# EAGLE design PSU (EAGLE 7.7.0)
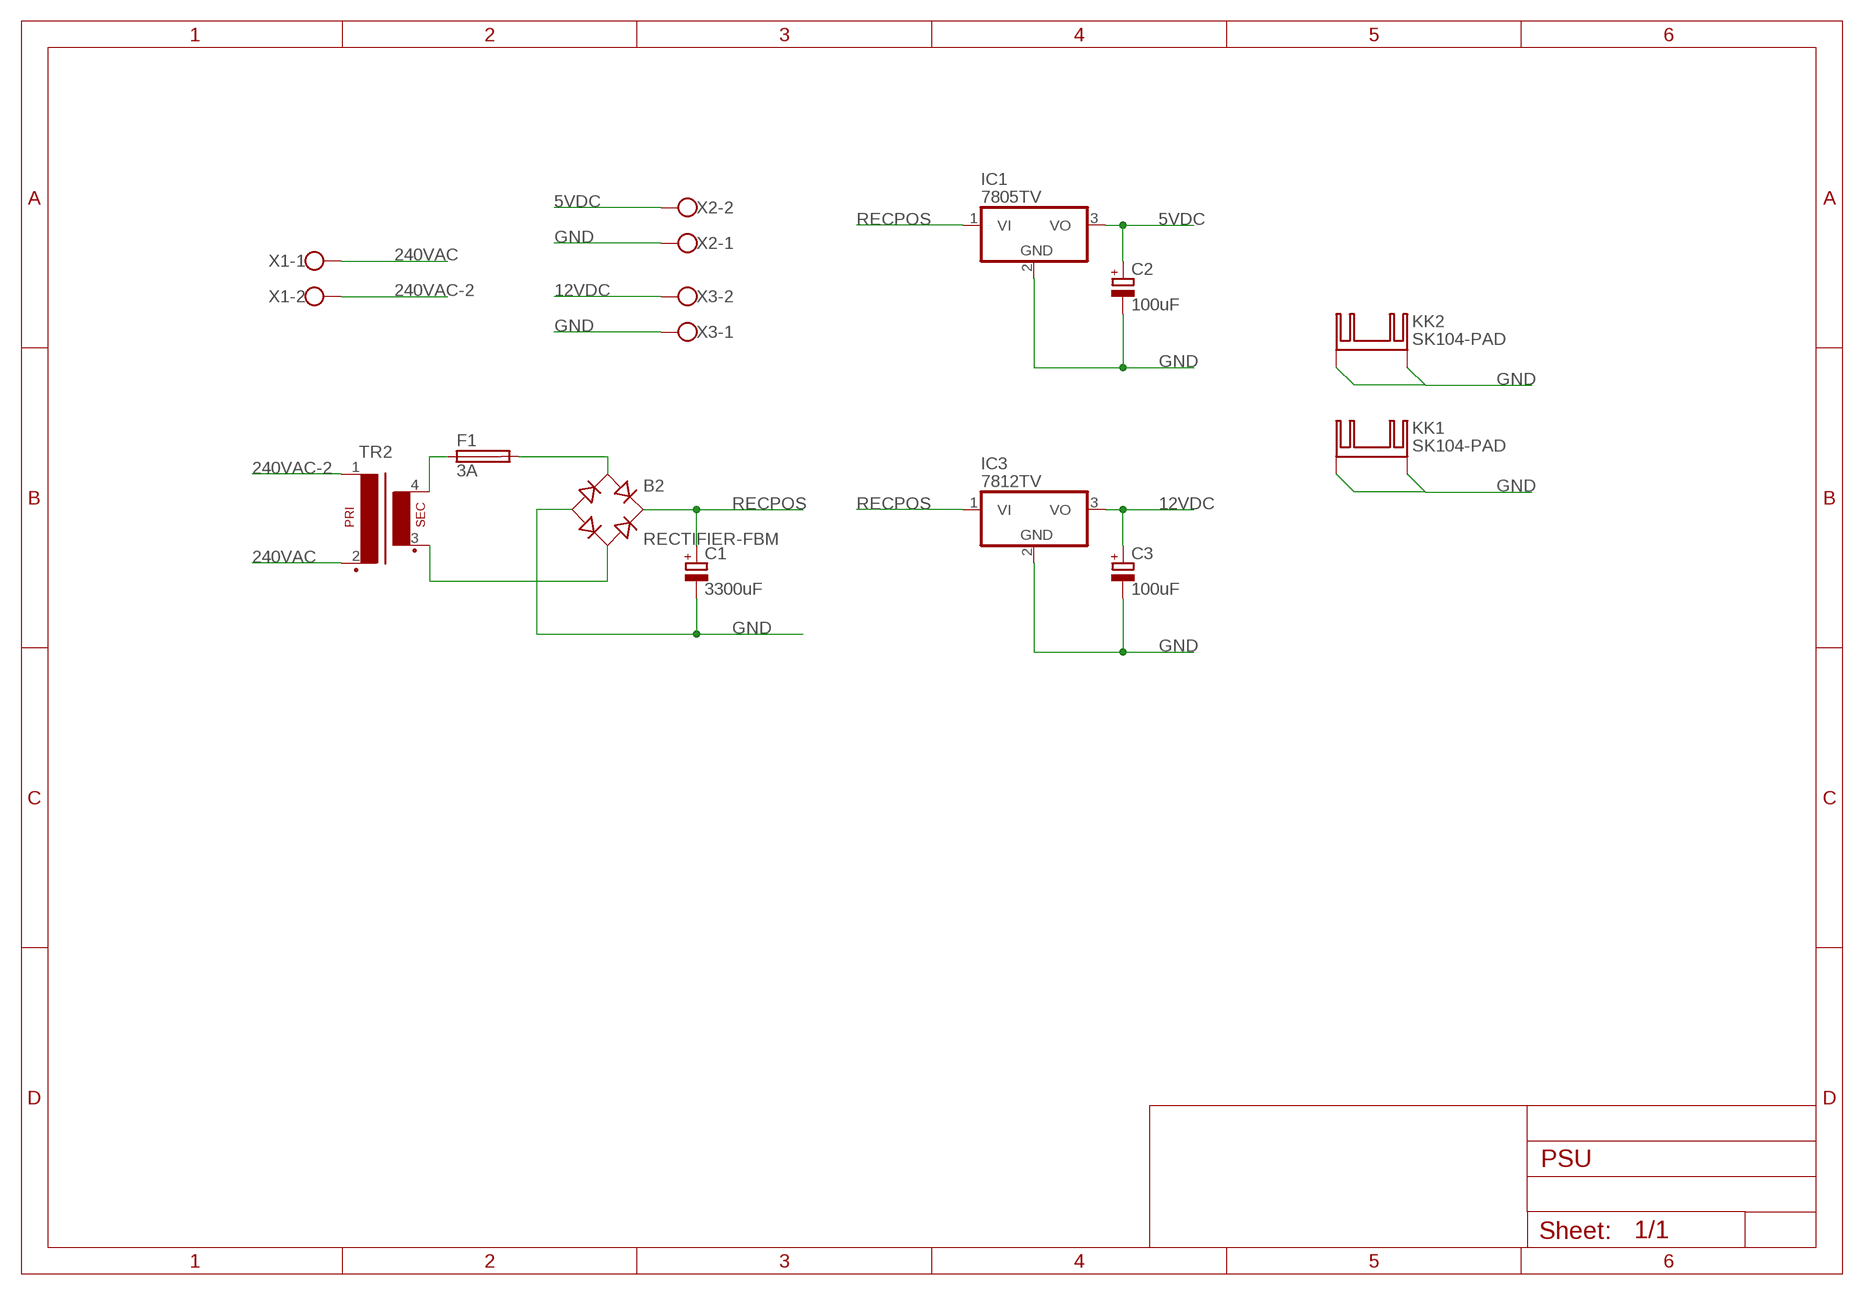
[diagram p0: schematic, sheet 1]

## Parts
B2  RECTIFIER-FBM  [FBM]
C1  3300uF  CPOL-EUE10-35  [EB35D]
C2  100uF  CPOL-EUE5-10.5  [E5-10,5]
C3  100uF  CPOL-EUE5-10.5  [E5-10,5]
F1  3A  SH25  [SH25]
IC1  7805TV  [TO220V]
IC3  7812TV  [TO220V]
KK1  SK104-PAD  [SK104-PAD]
KK2  SK104-PAD  [SK104-PAD]
TR2  VP31  [VP31]
X1  W237-102  [W237-102]
X2  W237-102  [W237-102]
X3  W237-102  [W237-102]

## Nets
5VDC: C2.+ IC1.3(VO) X2.2
12VDC: C3.+ IC3.3(VO) X3.2
240VAC: TR2.2 X1.1
240VAC-2: TR2.1 X1.2
GND: B2.- C1.- C2.- C3.- IC1.2(GND) IC3.2(GND) KK1.K1(K) KK1.K2(K) KK2.K1(K) KK2.K2(K) X2.1 X3.1
N$3: F1.1 TR2.4(S4)
N$4: B2.AC2 TR2.3(S3)
N$5: B2.AC1 F1.2
RECPOS: B2.+ C1.+ IC1.1(VI) IC3.1(VI)

## Library data of the parts
B2 = rectifier:RECTIFIER-: Rectifier
C1-C3 = rcl:CPOL-EU: POLARIZED CAPACITOR, European symbol
F1 = fuse:SH25: FUSE HOLDER grid 25 mm, OGN0031 8211, Schurter (Buerklin)
IC1 IC3 = linear:78*: Positive VOLTAGE REGULATOR Source: http://cache.national.com/ds/LM/LM78L05.pdf http://www.fairchildsemi.com/ds/LM/LM7805.pdf
KK1 KK2 = heatsink:SK104-PAD: HEATSINK manufacturer Fischer/distributor Buerklin
TR2 = trafo:VP31: TRANSFORMER 1 primary winding, 1 secondary winding BLOCK
X1-X3 = con-wago-500:W237-102: WAGO SCREW CLAMP

## Board
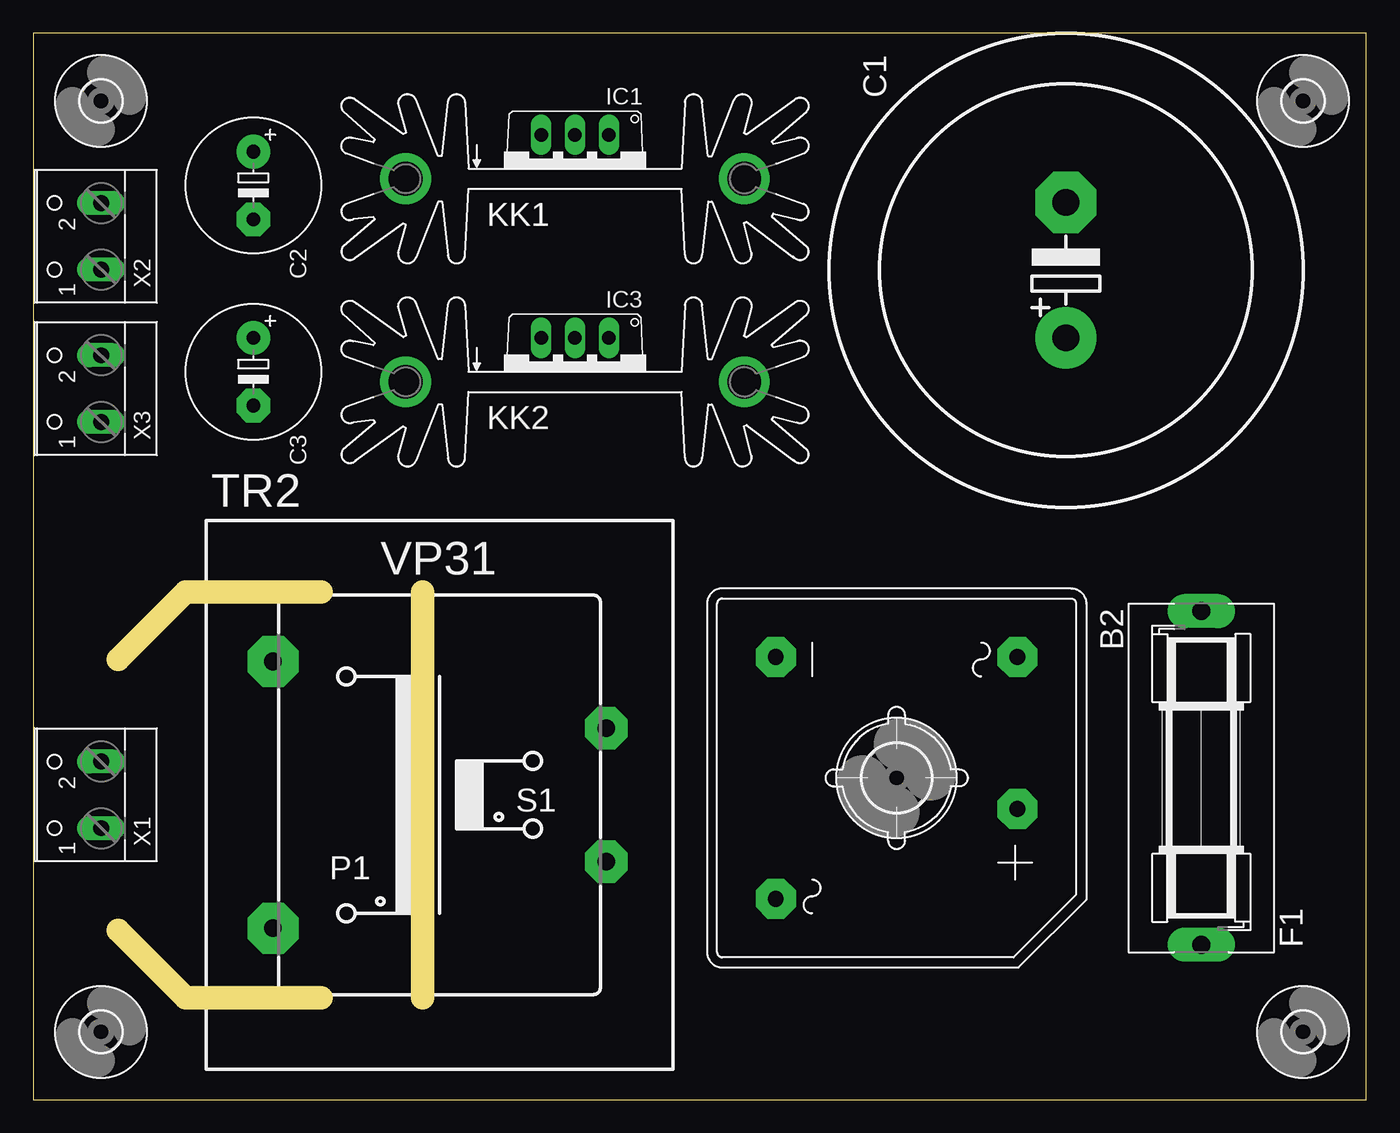
[diagram p1: board, top side]
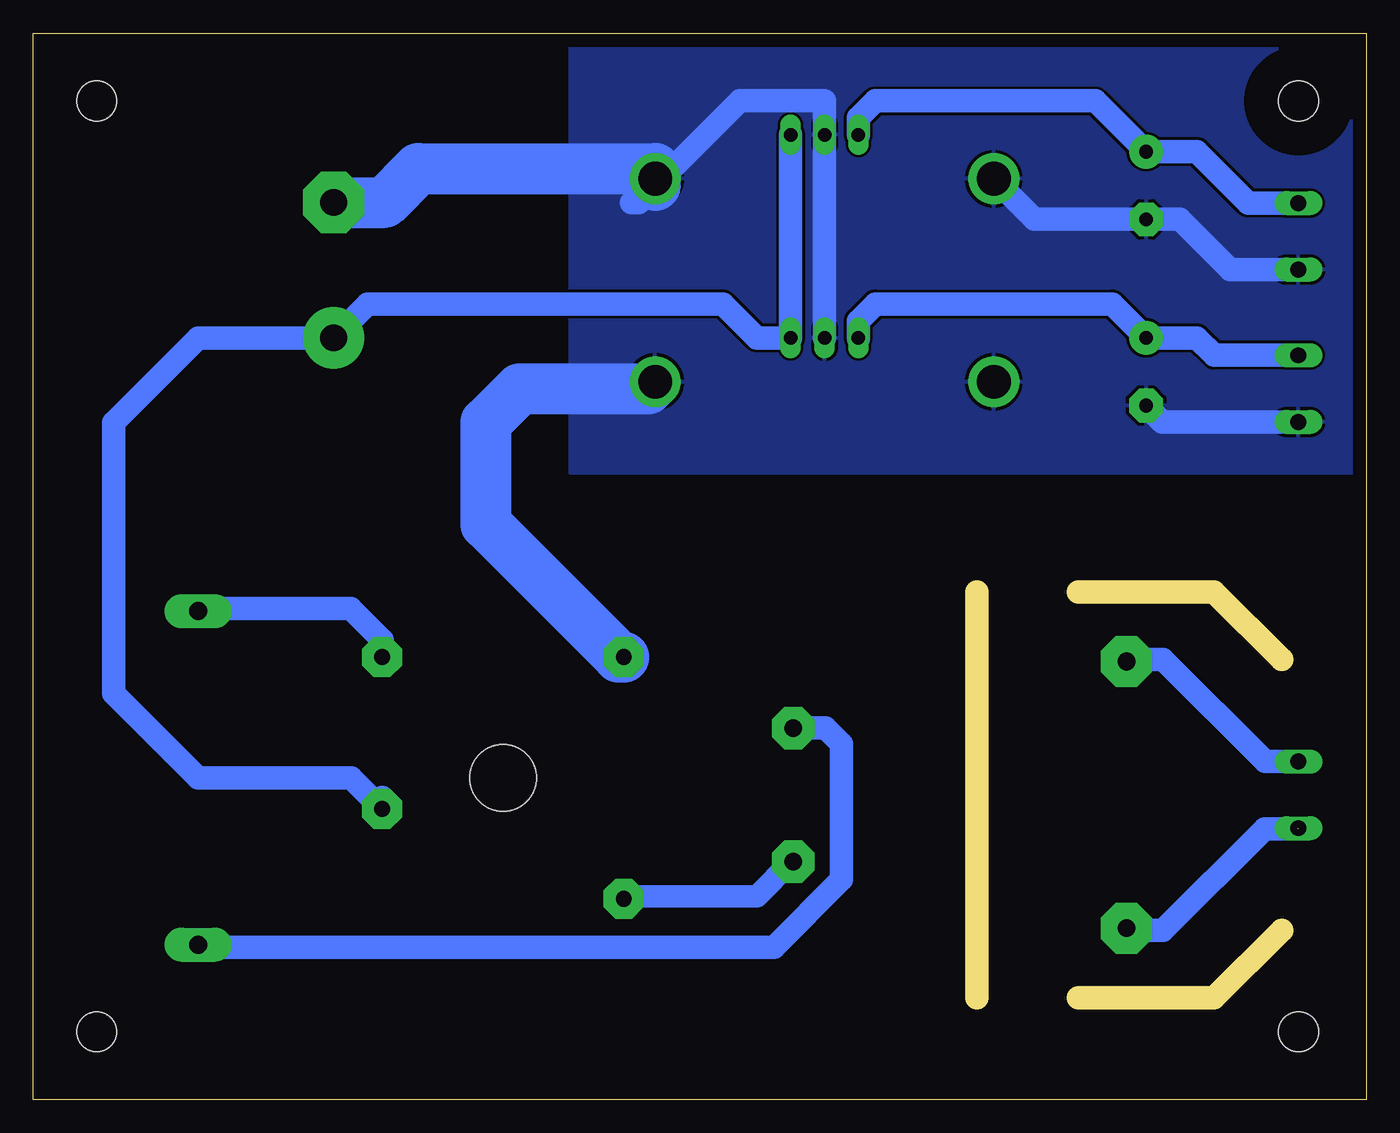
[diagram p2: board, bottom side, seen from below]

Size 100 x 80 mm. Coordinates in mm from the lower left corner, seen from the top.
Outline: 0,0 100,0 100,80 0,80 0,0
Copper layers (1*16): Top 0.035mm / dielectric 1.5mm / Bottom 0.035mm
Design rules "default": minimum track width 10mil, minimum drill 24mil, track to track 8mil, track to pad 8mil, pad to pad 8mil, via to via 8mil, smd to smd 8mil, copper to edge 40mil, drill to drill 8mil, minimum pad ring 10mil, minimum via ring 8mil, stop-mask expansion 4mil, vias tented up to drill 0mil, thermal gap 10mil
tKeepout: area 0,0 to 100.3,44.5; area 59.7,44.5 to 100.3,80
bKeepout: area 0,0 to 100.3,44.5; area 59.7,44.5 to 100.3,80
Milling: 5 lines

### Footprints (pad centres in the part's own frame; a part is rotated, then mirrored left to right if it is on the bottom)
FBM = drill 1.194 pad 3 octagon: + 2.337,9.068; - -9.068,-9.068; AC1 -9.068,9.068; AC2 9.068,-9.068
EB35D = drill 2.007 pad 4.597: + -5.08,0 | drill 2.007 pad 4.597 octagon: - 5.08,0
E5-10,5 = drill 1.016 pad 2.54: + -2.54,0 | drill 1.016 pad 2.54 octagon: - 2.54,0
SH25 = drill 1.321 pad 2.54 long: 1 -12.522,0; 2 12.522,0
TO220V = drill 1.016 long: 1 -2.54,-2.54; 2 0,-2.54; 3 2.54,-2.54
SK104-PAD = drill 2.54 pad 3.81: K1 -12.7,-0.762; K2 12.7,-0.762
VP31 = drill 1.321 pad 3.81 octagon: 1 -12.497,10.008; 2 -12.497,-10.008 | drill 1.321 pad 3.175 octagon: 3 12.497,-5.004; 4 12.497,5.004
3,0 = hole 3: 0,0
5,0 = hole 5: 0,0
W237-102 = drill 1.194 long: 1 -2.5,-1.27; 2 2.5,-1.27

### Placement (x,y rotation side)
B2  64.77,24.13 270 top
C1  77.47,62.23 90 top
C2  16.51,68.58 270 top
C3  16.51,54.61 270 top
F1  87.63,24.13 90 top
IC1  40.64,69.85 180 top
IC3  40.64,54.61 180 top
KK1  40.64,69.85 0 top
KK2  40.64,54.61 0 top
TR2  30.48,22.86 0 top
U$1  [3,0]  5.08,5.08 0 top
U$2  [3,0]  95.25,5.08 0 top
U$3  [3,0]  95.25,74.93 0 top
U$4  [3,0]  5.08,74.93 0 top
U$5  [5,0]  64.77,24.13 0 top
X1  3.81,22.86 90 top
X2  3.81,64.77 90 top
X3  3.81,53.34 90 top

### Tracks (layer width: path | path; a pad name or v marks a point on that pad's centre or on a via)
5VDC
  Bottom 1.778: IC1.3 38.1,73.66 36.83,74.93 20.32,74.93 C2.+ 12.7,71.12 8.85,67.27 X2.2
12VDC
  Bottom 1.778: IC3.3 38.1,58.42 36.83,59.69 19.05,59.69 C3.+ 12.7,57.15 11.39,55.84 X3.2
240VAC  (1 unrouted)
  Bottom 1.778: 5.08,20.32 7.62,20.32 15.24,12.7 17.83,12.7 TR2.2
240VAC-2
  Bottom 1.778: X1.2 7.58,25.36 15.24,33.02 17.83,33.02
  Bottom 2.54: 17.83,33.02 TR2.1
GND
  Bottom 1.778: KK1.K2 55.12,67.31 54.61,67.31 53.34,68.58 46.99,74.93 40.64,74.93 IC1.2 IC3.2 | X3.1 15.28,50.84 C3.- | X2.1 10.2,62.27 13.97,66.04 C2.- 24.89,66.04 KK1.K1
  Bottom 3.81: C1.- 73.66,67.31 71.12,69.85 53.34,69.85 53.34,68.58 | B2.- 56.06,33.2 66.04,43.18 66.04,50.8 63.5,53.34 53.85,53.34 KK2.K2
  pour Bottom: -7.62,83.82 -7.62,46.99 59.69,46.99 59.69,85.09 55.88,85.09 -6.35,85.09
N$3
  Bottom 1.778: 43.26,27.86 TR2.4 40.56,27.86 39.37,26.67 39.37,16.51 44.45,11.43 87.45,11.43 F1.1
N$4
  Bottom 1.676: TR2.3 43.1,17.86 45.72,15.24 55.88,15.24 B2.AC2
N$5
  Bottom 1.778: B2.AC1 73.84,34.47 76.2,36.83 87.45,36.83 F1.2
RECPOS
  Bottom 1.778: 73.84,22.68 B2.+ 76.17,24.13 87.63,24.13 93.98,30.48 93.98,50.8 87.63,57.15 C1.+ 74.93,59.69 48.26,59.69 45.72,57.15 IC3.1 IC1.1

### Text on the board
tOrigins: (c)2018 Dr Andy's / Frazzle Board